# Altium schematic sheet MineSafe.SchDoc
size 309 x 148 mm; SheetNumber: 1; SheetTotal: 1
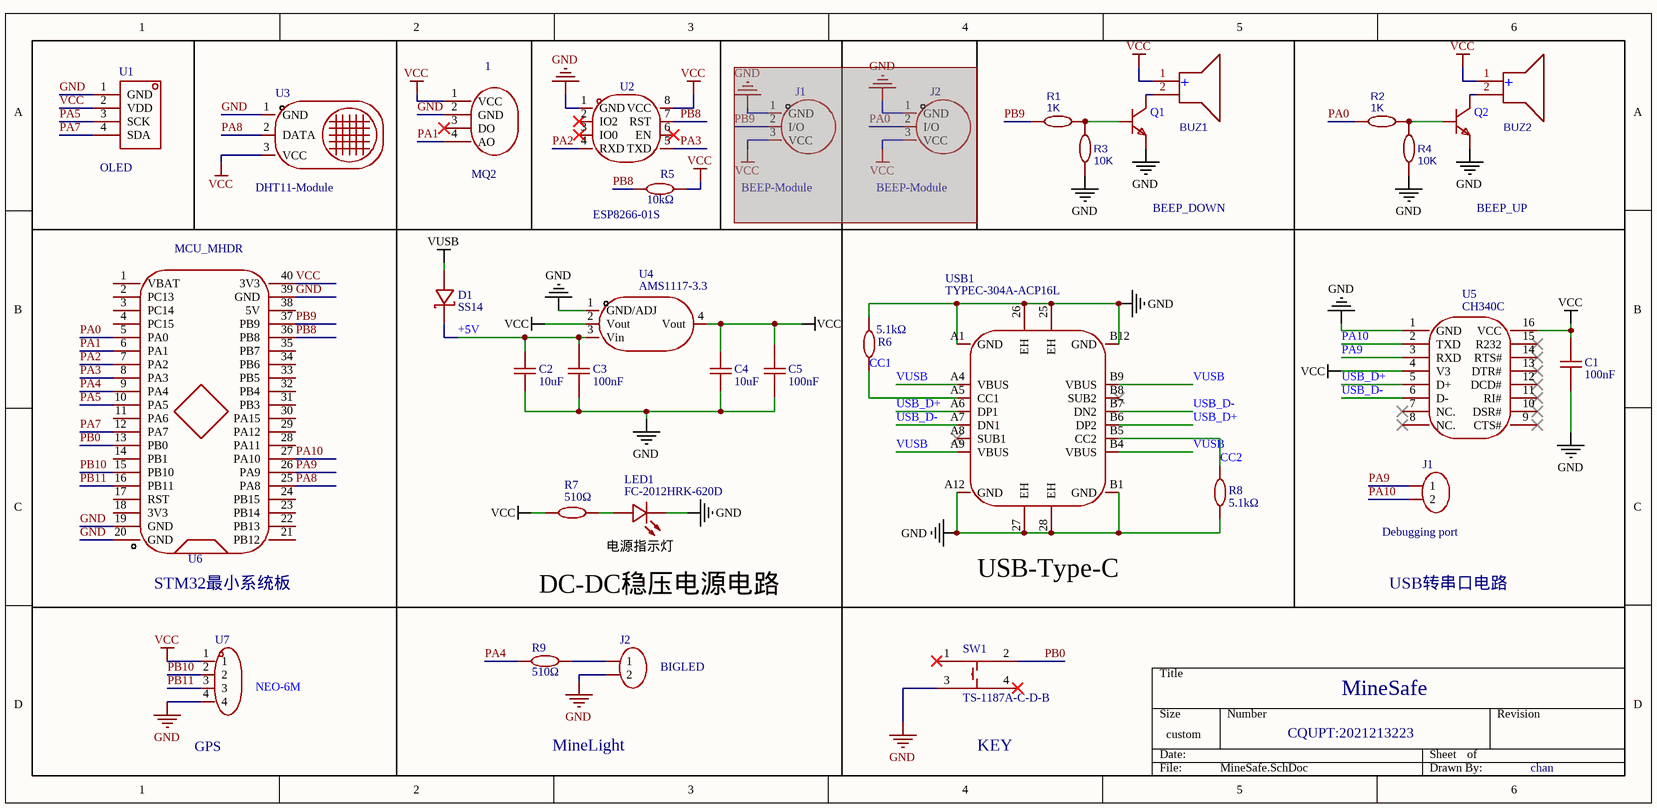
[diagram p0: MineSafe.SchDoc]

## Parts
(Parts that share a designator on the sheet are numbered #1, #2 ... from top to bottom, then left to right.)
1  MQ2  [mq2]
BUZ1  HNB09A03 3.3V  [BUZ-TH_BD9.0-P5.00-D0.6-FD]  (value not drawn)
BUZ2  HNB09A03 3.3V  [BUZ-TH_BD9.0-P5.00-D0.6-FD]  (value not drawn)
C1  100nF  [C0603]
C2  10uF  [C0603]
C3  100nF  [C0603]
C4  10uF  [C0603]
C5  100nF  [C0603]
D1  SS14  [SMA_L4.2-W2.6-LS5.3-RD]
J1#1  BEEP-Module  [HDR-F-2.54_1X3]  (masked out: inside a compile mask, not in the netlist)
J1#2  Debugging port  [HDR-M-2.54_1X2]
J2#1  BEEP-Module  [HDR-F-2.54_1X3]  (masked out: inside a compile mask, not in the netlist)
J2#2  BIGLED  [HDR-M-2.54_1X2]
LED1  FC-2012HRK-620D  [LED0805-RD_RED]
Q1  (no value)  [S8050_SOT-23]
Q2  (no value)  [S8050_SOT-23]
R1  1K  [R0603_SMD-CRCW060327R0FKEA]
R2  1K  [R0603_SMD-CRCW060327R0FKEA]
R3  10K  [R0603_SMD-CRCW060327R0FKEA]
R4  10K  [R0603_SMD-CRCW060327R0FKEA]
R5  10kΩ  [R0603]
R6  5.1kΩ  [R0603]
R7  510Ω  [R0603]
R8  5.1kΩ  [R0603]
R9  510Ω  [R0603]
SW1  TS-1187A-C-D-B  [KEY-SMD_4P-L5.2-W5.2-P3.7-LS6.4-TL]
U1  OLED  [0.96oled]
U2  ESP8266-01S  [WIFIM-TH_ESP8266-01S]
U3  DHT11-Module  [HDR-F-2.54_1X3]
U4  AMS1117-3.3  [SOT-223-3_L6.5-W3.4-P2.30-LS7.0-BR]
U5  CH340C  [SOP-16_L10.0-W3.9-P1.27-LS6.0-BL]
U6  MCU_MHDR  [STM32F103C8T6-BLUEPILL]
U7  NEO-6M  [TH_ATK-NEO-6M]
USB1  TYPEC-304A-ACP16L  [USB-C-SMD_XUNPU_TYPEC-304A-ACP16L]

## Nets
GND: 1.2(GND) C1.2 C2.1 C3.1 C4.1 C5.1 J2#2.2 LED1.1(-) Q1.2 Q2.2 R3.2 R4.2 R6.2 R8.1 SW1.3 U1.1(GND) U2.1(GND) U3.1(GND) U4.1(GND/ADJ) U5.1(GND) U6.19(GND) U6.20(GND) U6.39(GND) U7.4 USB1.25(EH) USB1.26(EH) USB1.27(EH) USB1.28(EH) USB1.A1(GND) USB1.A12(GND) USB1.B1(GND) USB1.B12(GND)
VCC: 1.1(VCC) BUZ1.1(+) BUZ2.1(+) C1.1 C4.2 C5.2 R5.2 R7.2 U1.2(VDD) U2.8(VCC) U3.3(VCC) U4.2(Vout) U4.4(Vout) U5.4(V3) U5.16(VCC) U6.40(3V3) U7.1
VUSB: D1.2(A) USB1.A4(VBUS) USB1.A9(VBUS) USB1.B4(VBUS) USB1.B9(VBUS)
+5V: C2.2 C3.2 D1.1(K) U4.3(Vin)
CC1: R6.1 USB1.A5(CC1)
CC2: R8.2 USB1.B5(CC2)
PA0: R2.2 U6.5(PA0)
PA1: 1.4(AO) U6.6(PA1)
PA2: U2.4(RXD) U6.7(PA2)
PA3: U2.5(TXD) U6.8(PA3)
PA4: R9.1 U6.9(PA4)
PA5: U1.3(SCK) U6.10(PA5)
PA7: U1.4(SDA) U6.12(PA7)
PA8: U3.2(DATA) U6.25(PA8)
PA9: J1#2.1 U5.3(RXD) U6.26(PA9)
PA10: J1#2.2 U5.2(TXD) U6.27(PA10)
PB0: SW1.2 U6.13(PB0)
PB8: R5.1 U2.7(RST) U6.36(PB8)
PB9: R1.2 U6.37(PB9)
PB10: U6.15(PB10) U7.2
PB11: U6.16(PB11) U7.3
USB_D+: U5.5(D+) USB1.A6(DP1) USB1.B6(DP2)
USB_D-: U5.6(D-) USB1.A7(DN1) USB1.B7(DN2)
NetBUZ1_2: BUZ1.2(-) Q1.3
NetBUZ2_2: BUZ2.2(-) Q2.3
NetJ2#2_1: J2#2.1 R9.2
NetLED1_2: LED1.2(+) R7.1
NetQ1_1: Q1.1 R1.1 R3.1
NetQ2_1: Q2.1 R2.1 R4.1

Not connected (* = marked no-connect by the designer): 1 3(DO)*; SW1 1* 4*; U2 2(IO2)* 3(IO0)* 6(EN)*; U5 7(NC.)* 8(NC.)* 9(CTS#)* 10(DSR#)* 11(RI#)* 12(DCD#)* 13(DTR#)* 14(RTS#)* 15(R232)*; U6 1(VBAT) 2(PC13) 3(PC14) 4(PC15) 11(PA6) 14(PB1) 17(RST) 18(3V3) 21(PB12) 22(PB13) 23(PB14) 24(PB15) 28(PA11) 29(PA12) 30(PA15) 31(PB3) 32(PB4) 33(PB5) 34(PB6) 35(PB7) 38(5V); USB1 A8(SUB1)* B8(SUB2)*

## Notes on the sheet
- BEEP_DOWN
- BEEP_UP
- 电源指示灯
- (near U6) STM32最小系统板
- DC-DC稳压电源电路
- USB-Type-C
- USB转串口电路
- MineSafe
- (near U7) GPS
- MineLight
- (near SW1) KEY
- CQUPT:2021213223
- chan

## Library data of the parts
1 = MQ2: Convert to PCB: yes; Symbol: MQ2; Device: MQ2; Add into BOM: yes
BUZ1 BUZ2 = HNB09A03 3.3V: Manufacturer: Jiangsu Huaneng Elec; Contributor: LCSC; Supplier: LCSC; Supplier Part: C96102; Manufacturer Part: HNB09A03; spicePre: B; spiceSymbolName: HNB09A03 3.3V
C1 C3 C5 = 100nF: Manufacturer: YAGEO; Manufacturer Part: CC0603KRX7R9BB104; Convert to PCB: yes; nameAlias: Capacitance; Symbol: 100nF; Device: 100nF; Supplier: LCSC; Supplier Part: C14663; JLCPCB Part Class: Basic; JLCPCB SMD: Yes; Add into BOM: yes; Origin Footprint: C0603; spicePre: C; spiceSymbolName: CC0603KRX7R9BB104
C2 C4 = 10uF: Manufacturer: FH; Manufacturer Part: 0603X106K160NT; Convert to PCB: yes; nameAlias: Capacitance; Symbol: 10uF; Device: 10uF; Supplier: LCSC; Supplier Part: C70225; Add into BOM: yes; Origin Footprint: C0603; spicePre: C; spiceSymbolName: 0603X106K160NT
D1 = SS14: Manufacturer: MDD; Convert to PCB: yes; Symbol: SS14; Device: SS14; Supplier: LCSC; Manufacturer Part: SS14; Supplier Part: C2480; JLCPCB Part Class: Basic Part; Add into BOM: yes; Origin Footprint: SMA_L4.2-W2.6-LS5.3-RD; spicePre: D; spiceSymbolName: SS14
J1#1 J2#1 = BEEP-Module: Convert to PCB: yes; Symbol: BEEP-Module; Device: BEEP-Module; Add into BOM: yes
J1#2 J2#2 = HDR-M-2.54_1x2: Convert to PCB: yes; Contributor: LCEDA_Lib; Symbol: HDR-M-2.54_1x2; Device: HDR-M-2.54_1x2; Supplier Part: C124375; Supplier: LCSC; Add into BOM: yes; Origin Footprint: HDR-M-2.54_1X2; spicePre: J; spiceSymbolName: HDR-M-2.54_1x2
LED1 = FC-2012HRK-620D: Manufacturer: NATIONSTAR; Convert to PCB: yes; Symbol: FC-2012HRK-620D; Device: FC-2012HRK-620D; Supplier: LCSC; Manufacturer Part: FC-2012HRK-620D; Supplier Part: C84256; JLCPCB Part Class: Basic Part; Add into BOM: yes; Origin Footprint: LED0805-RD_RED; spicePre: L; spiceSymbolName: FC-2012HRK-620D
Q1 Q2 = S8050_SOT_NPN: Symbol: NPN; Convert to PCB: yes; Device: S8050_SOT_NPN; Add into BOM: yes; Supplier Footprint: SOT-23
R1 R2 = 1K: Manufacturer: UniOhm; Manufacturer Part: 0603WAF1001T5E; nameAlias: Resistance (Ohms); SMT Type: Basic; Supplier: LCSC; LCSC Assembly: Yes; Supplier Part: C21190; spicePre: R; spiceSymbolName: 0603WAF1001T5E
R3 R4 = 10K: Manufacturer: UniOhm; Manufacturer Part: 0603WAF1002T5E; nameAlias: Resistance (Ohms); SMT Type: Basic; Supplier: LCSC; LCSC Assembly: Yes; Supplier Part: C25804; spicePre: R; spiceSymbolName: 0603WAF1002T5E
R5 = 10kΩ: Manufacturer: UNI-ROYAL(厚声); Manufacturer Part: 0603WAF1002T5E; Resistance: 10K; Convert to PCB: yes; nameAlias: Resistance; Symbol: 10kΩ; Device: 10kΩ; Supplier: LCSC; Supplier Part: C25804; JLCPCB Part Class: Basic Part; Add into BOM: yes; Origin Footprint: R0603; spicePre: R; spiceSymbolName: 0603WAF1002T5E
R6 R8 = 5.1kΩ: Manufacturer Part: 0603WAF5101T5E; Manufacturer: UniOhm; Resistance: 5.1K; Convert to PCB: yes; nameAlias: Resistance; Symbol: 5.1kΩ; Device: 5.1kΩ; Supplier: LCSC; Supplier Part: C23186; JLCPCB Part Class: Basic Part; Add into BOM: yes; Origin Footprint: R0603; spicePre: R; spiceSymbolName: 0603WAF5101T5E
R7 R9 = 510Ω: Manufacturer: UniOhm; Manufacturer Part: 0603WAF5100T5E; Resistance: 510; Convert to PCB: yes; nameAlias: Resistance; Symbol: 510Ω; Device: 510Ω; Supplier: LCSC; Supplier Part: C23193; JLCPCB Part Class: Basic Part; Add into BOM: yes; Origin Footprint: R0603; spicePre: R; spiceSymbolName: 0603WAF5100T5E
SW1 = TS-1187A-C-D-B: Manufacturer: XKB Connectivity(中国星坤); Convert to PCB: yes; Contributor: LCSC; Symbol: TS-1187A-C-D-B; Device: TS-1187A-C-D-B; Supplier: LCSC; Supplier Part: C318888; Manufacturer Part: TS-1187A-C-D-B; JLCPCB Part Class: Extended Part; Add into BOM: yes; Origin Footprint: KEY-SMD_4P-L5.2-W5.2-P3.7-LS6.4-TL; spicePre: S; spiceSymbolName: TS-1187A-C-D-B
U1 = 0.96OLED: Add into BOM: yes; Symbol: 0.96OLED; Device: 0.96OLED; Convert to PCB: yes
U2 = ESP8266-01S: Add into BOM: yes; Symbol: ESP8266-01S; Device: ESP8266-01S; LCSC Part Name: ESP8266-01S; Supplier Part: C9900150497; Manufacturer Part: ESP8266-01S; Supplier Footprint: TH-8P; JLCPCB Part Class: 扩展库; Supplier: LCSC; Convert to PCB: yes
U3 = DHT11-Module: Convert to PCB: yes; Contributor: drswith; Symbol: DHT11-Module; Device: DHT11-Module; Add into BOM: yes; Origin Footprint: HDR-F-2.54_1X3; spicePre: U; spiceSymbolName: DHT11-Module
U4 = AMS1117-3.3: Manufacturer: AMS; Convert to PCB: yes; sourceId: dwIGgezVh; Symbol: AMS1117-3.3; Device: AMS1117-3.3; Supplier: LCSC; Manufacturer Part: AMS1117-3.3; image: //image.lceda.cn/szlcsc/C6186.jpg; Supplier Part: C6186; JLCPCB Part Class: Basic; JLCPCB SMD: Yes; Add into BOM: yes; Origin Footprint: SOT-223-3_L6.5-W3.4-P2.30-LS7.0-BR; timeStamp: 1476261164; spicePre: U; spiceSymbolName: AMS1117-3.3
U5 = CH340C: Manufacturer: WCH; Convert to PCB: yes; Symbol: CH340C; Device: CH340C; Supplier: LCSC; Manufacturer Part: CH340C; Supplier Part: C84681; JLCPCB Part Class: Extended Part; Add into BOM: yes; Origin Footprint: SOP-16_L10.0-W3.9-P1.27-LS6.0-BL; spicePre: U; spiceSymbolName: CH340C
U6 = STM32F103C8T6-Bluepill: Convert to PCB: yes; Contributor: drswith; Symbol: STM32F103C8T6-Bluepill; Device: STM32F103C8T6-Bluepill; Add into BOM: yes; Origin Footprint: STM32F103C8T6-BLUEPILL; spicePre: U; spiceSymbolName: STM32F103C8T6-Bluepill
U7 = ATK-NEO-6M: Add into BOM: yes; Symbol: ATK-NEO-6M; Device: ATK-NEO-6M; LCSC Part Name: ATK-NEO-6M; Supplier Part: C9900025554; Manufacturer Part: ATK-NEO-6M; Supplier Footprint: THrough hole; JLCPCB Part Class: 扩展库; Supplier: LCSC; Convert to PCB: yes
USB1 = TYPEC-304A-ACP16L: Manufacturer: XUNPU(讯普); Convert to PCB: yes; Contributor: LCSC; Symbol: TYPEC-304A-ACP16L; Device: TYPEC-304A-ACP16L; Supplier: LCSC; Supplier Part: C2909609; Manufacturer Part: TYPEC-304A-ACP16L; JLCPCB Part Class: Extended Part; Add into BOM: yes; Origin Footprint: USB-C-SMD_XUNPU_TYPEC-304A-ACP16L; spicePre: U; spiceSymbolName: TYPEC-304A-ACP16L